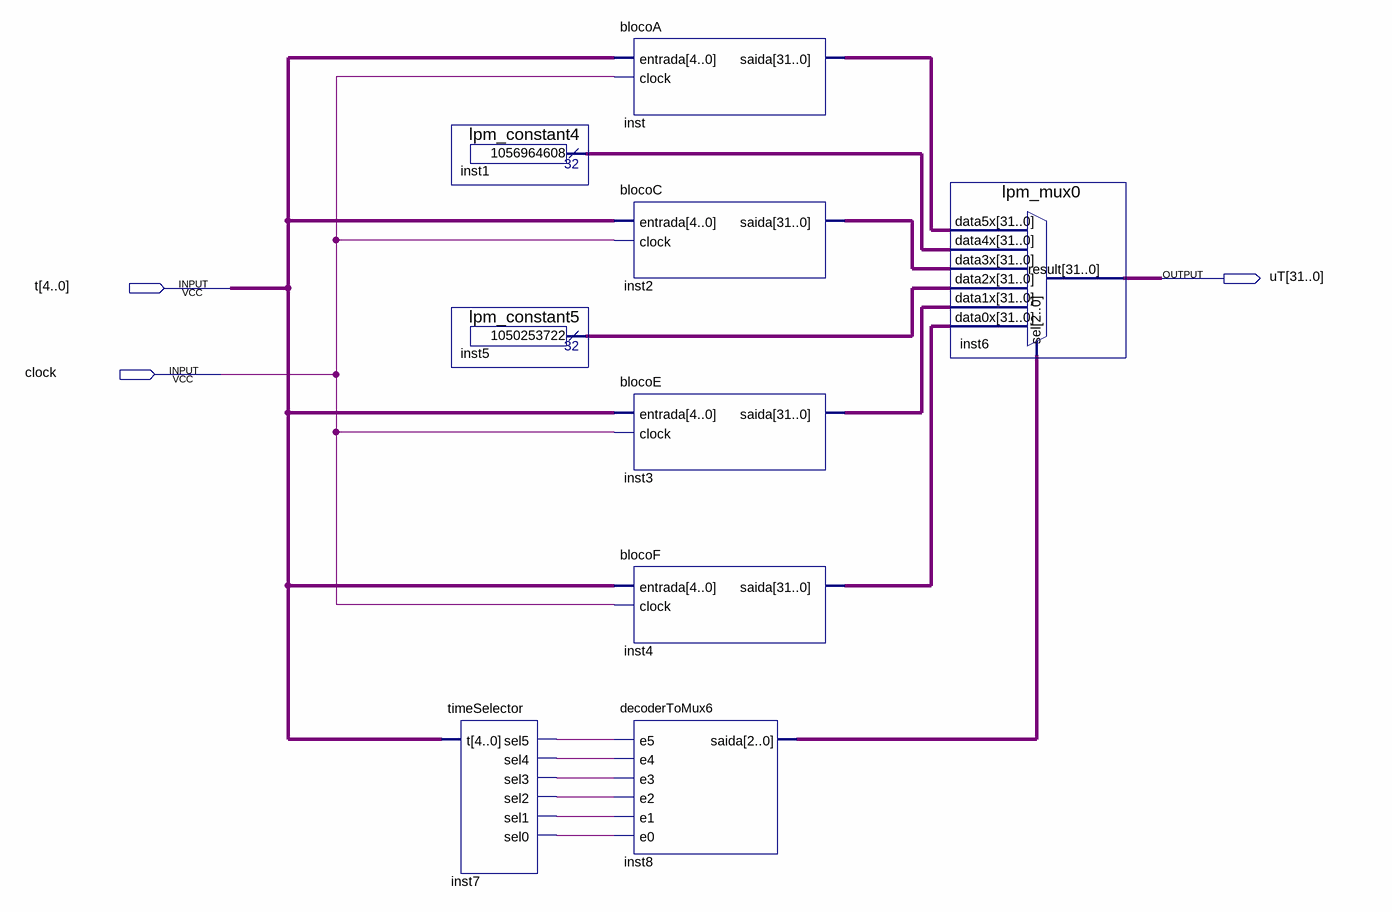
[diagram p0: schematic sheet]
// Quartus schematic uT.bdf as structural Verilog: 9 symbols, 3 pins
module uT (
  input  [4:0] t,
  input  clock,
  output [31:0] uT
);

  wire inst7_sel0, inst7_sel1, inst7_sel2, inst7_sel3, inst7_sel4, inst7_sel5;
  wire [2:0] inst8_saida;
  wire [31:0] inst1_result, inst2_saida, inst3_saida, inst4_saida, inst5_result, inst_saida;

  timeSelector inst7 (
    .t(t), .sel5(inst7_sel5), .sel4(inst7_sel4), .sel3(inst7_sel3), .sel2(inst7_sel2), .sel1(inst7_sel1),
    .sel0(inst7_sel0));
  lpm_constant4 inst1 (.result(inst1_result));
  lpm_constant5 inst5 (.result(inst5_result));
  blocoA inst (.entrada(t), .clock(clock), .saida(inst_saida));
  blocoC inst2 (.entrada(t), .clock(clock), .saida(inst2_saida));
  blocoE inst3 (.entrada(t), .clock(clock), .saida(inst3_saida));
  blocoF inst4 (.entrada(t), .clock(clock), .saida(inst4_saida));
  decoderToMux6 inst8 (
    .e5(inst7_sel5), .e4(inst7_sel4), .e3(inst7_sel3), .e2(inst7_sel2), .e1(inst7_sel1), .e0(inst7_sel0),
    .saida(inst8_saida));
  lpm_mux0 inst6 (
    .data5x(inst_saida), .data4x(inst1_result), .data3x(inst2_saida), .data2x(inst5_result),
    .data1x(inst3_saida), .data0x(inst4_saida), .sel(inst8_saida), .result(uT));
endmodule
